# EAGLE schematic Alimentacion_doble (EAGLE 7.7.0)
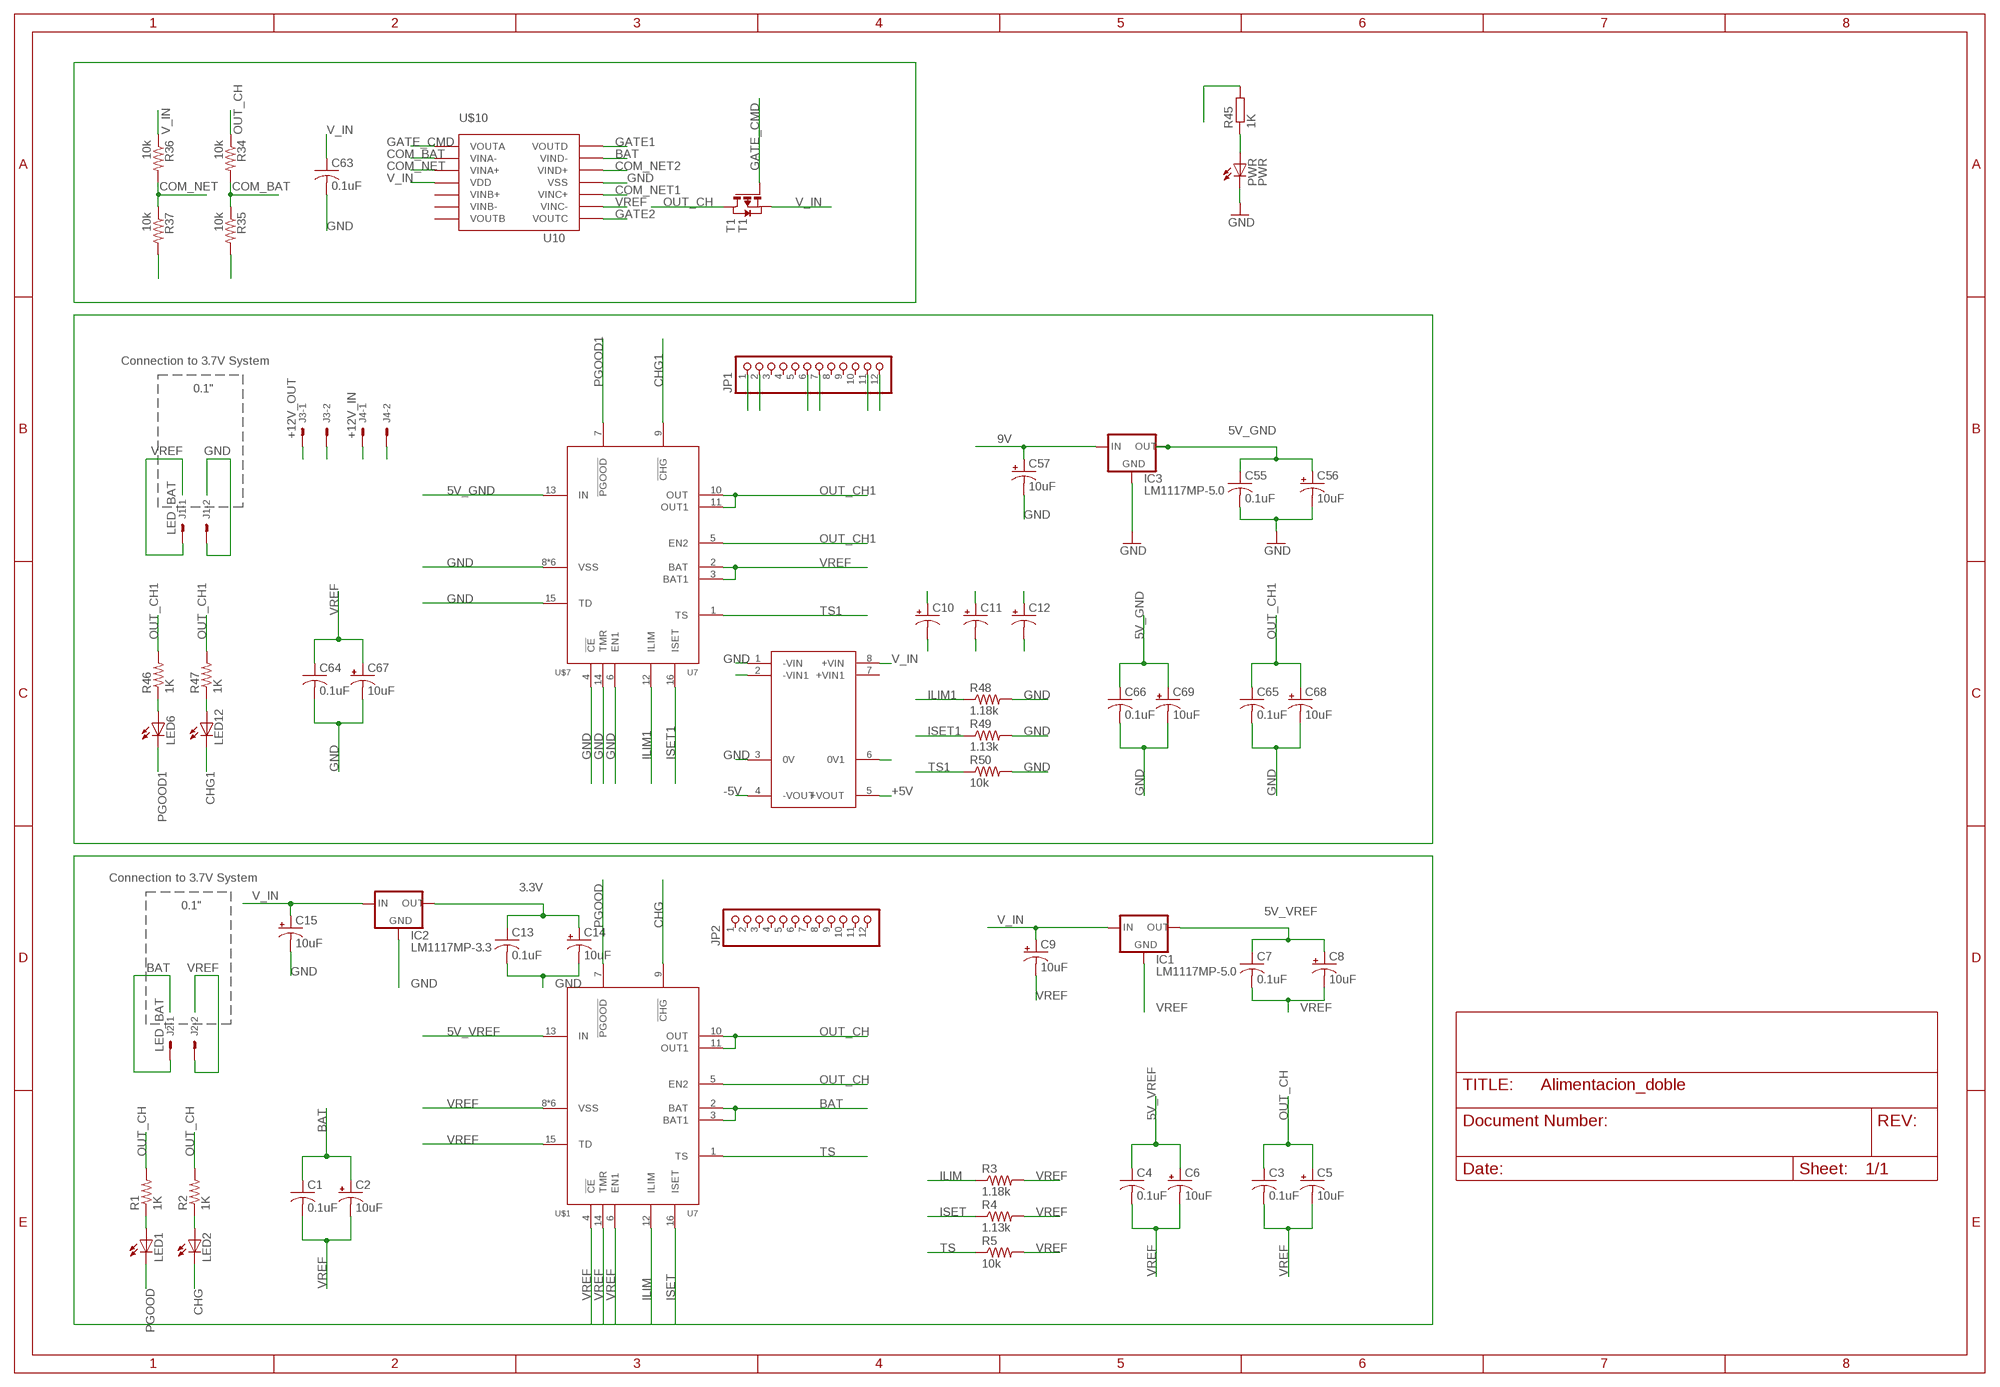
[diagram p0: schematic, sheet 1]

## Parts
C1  0.1uF  C-USC0805K  [C0805K]
C2  10uF  CPOL-USB/3528-21W  [B/3528-21W]
C3  0.1uF  C-USC0805K  [C0805K]
C4  0.1uF  C-USC0805K  [C0805K]
C5  10uF  CPOL-USB/3528-21W  [B/3528-21W]
C6  10uF  CPOL-USB/3528-21W  [B/3528-21W]
C7  0.1uF  C-USC0805K  [C0805K]
C8  10uF  CPOL-USB/3528-21W  [B/3528-21W]
C9  10uF  CPOL-USB/3528-21W  [B/3528-21W]
C10  CPOL-USB/3528-21W  [B/3528-21W]
C11  CPOL-USB/3528-21W  [B/3528-21W]
C12  CPOL-USB/3528-21W  [B/3528-21W]
C13  0.1uF  C-USC0805K  [C0805K]
C14  10uF  CPOL-USB/3528-21W  [B/3528-21W]
C15  10uF  CPOL-USB/3528-21W  [B/3528-21W]
C55  0.1uF  C-USC0805K  [C0805K]
C56  10uF  CPOL-USB/3528-21W  [B/3528-21W]
C57  10uF  CPOL-USB/3528-21W  [B/3528-21W]
C63  0.1uF  C-USC0805K  [C0805K]
C64  0.1uF  C-USC0805K  [C0805K]
C65  0.1uF  C-USC0805K  [C0805K]
C66  0.1uF  C-USC0805K  [C0805K]
C67  10uF  CPOL-USB/3528-21W  [B/3528-21W]
C68  10uF  CPOL-USB/3528-21W  [B/3528-21W]
C69  10uF  CPOL-USB/3528-21W  [B/3528-21W]
IC1  LM1117MP-5.0  [SOT223]
IC2  LM1117MP-3.3  LM1117MP-5.0  [SOT223]
IC3  LM1117MP-5.0  [SOT223]
J1  LED_BAT  22-27-2021-02  [6410-02]
J2  LED_BAT  22-27-2021-02  [6410-02]
J3  +12V_OUT  22-27-2021-02  [6410-02]
J4  +12V_IN  22-27-2021-02  [6410-02]
JP1  PINHD-1X12  [1X12]
JP2  PINHD-1X12  [1X12]
LED1  LED3MM  [LED3MM]
LED2  LED3MM  [LED3MM]
LED6  LED3MM  [LED3MM]
LED12  LED3MM  [LED3MM]
PWR  PWR  LED3MM  [LED3MM]
R1  1K  R-US_M0805  [M0805]
R2  1K  R-US_M0805  [M0805]
R3  1.18k  R-US_M0805  [M0805]
R4  1.13k  R-US_M0805  [M0805]
R5  10k  R-US_M0805  [M0805]
R34  10k  R-US_M0805  [M0805]
R35  10k  R-US_M0805  [M0805]
R36  10k  R-US_M0805  [M0805]
R37  10k  R-US_M0805  [M0805]
R45  1K  R-EU_R0805  [R0805]
R46  1K  R-US_M0805  [M0805]
R47  1K  R-US_M0805  [M0805]
R48  1.18k  R-US_M0805  [M0805]
R49  1.13k  R-US_M0805  [M0805]
R50  10k  R-US_M0805  [M0805]
T1  T1  PMOSSOT23  [SOT-23]
U$1  U7  BQ24072VQFN-16  [BQ24232]
U$2  NDTD_CONVERTER  [NDTD_CONVERTER]
U$7  U7  BQ24072VQFN-16  [BQ24232]
U$10  U10  MCP6294TSSOP-14  [MCP6294]

## Nets
3.3V: C13.1 C14.+ IC2.2(OUT) IC2.4(OUT) JP1.6
5V_GND: C55.1 C56.+ C66.1 C69.+ IC3.2(OUT) IC3.4(OUT) U$7.13(IN)
5V_VREF: C4.1 C6.+ C7.1 C8.+ IC1.2(OUT) IC1.4(OUT) U$1.13(IN)
9V: C57.+ IC3.3(IN)
+5V: C12.+ JP1.1 U$2.5(+VOUT)
-5V: C11.+ JP1.12 U$2.4(-VOUT)
BAT: C1.1 C2.+ J2.1 U$1.2(BAT) U$1.3(BAT1) U$10.VIND-
CHG: LED2.K(C) U$1.9(!CHG!)
CHG1: LED12.K(C) U$7.9(!CHG!)
COM_BAT: R34.2 R35.1 U$10.VINA-
COM_NET: R36.2 R37.1 U$10.VINA+
COM_NET1: U$10.VINC+
COM_NET2: U$10.VIND+
GATE1: U$10.VOUTD
GATE2: U$10.VOUTC
GATE_CMD: T1.3(G) U$10.VOUTA
GND: C10.- C11.- C12.- C13.2 C14.- C15.- C55.2 C56.- C57.- C63.2 C64.2 C65.2 C66.2 C67.- C68.- C69.- IC2.1(GND) IC3.1(GND) J1.2 J3.2 J4.2 JP1.2 JP1.7 JP1.11 PWR.K(C) R35.2 R37.2 R48.2 R49.2 R50.2 U$2.1(-VIN) U$2.3(0V) U$2.6(0V1) U$7.4(!CE!) U$7.6(EN1) U$7.8(VSS) U$7.14(TMR) U$7.15(TD) U$7.NA0(VSS) U$7.NA1(VSS) U$7.NA2(VSS) U$7.NA3(VSS) U$7.NA4(VSS) U$10.VSS
ILIM: R3.1 U$1.12(ILIM)
ILIM1: R48.1 U$7.12(ILIM)
ISET: R4.1 U$1.16(ISET)
ISET1: R49.1 U$7.16(ISET)
N$1: LED1.A R1.1
N$2: LED2.A R2.1
N$7: U$2.2(-VIN1)
N$27: PWR.A R45.1
N$28: LED6.A R46.1
N$29: LED12.A R47.1
OUT_CH: C3.1 C5.+ R1.2 R2.2 R34.1 T1.1(D) U$1.5(EN2) U$1.10(OUT) U$1.11(OUT1)
OUT_CH1: C65.1 C68.+ R46.2 R47.2 U$7.5(EN2) U$7.10(OUT) U$7.11(OUT1)
PGOOD: LED1.K(C) U$1.7(!PGOOD!)
PGOOD1: LED6.K(C) U$7.7(!PGOOD!)
TS: R5.1 U$1.1(TS)
TS1: R50.1 U$7.1(TS)
V_IN: C9.+ C10.+ C15.+ C63.1 IC1.3(IN) IC2.3(IN) J3.1 J4.1 R36.1 R45.2 T1.2(S) U$2.8(+VIN) U$10.VDD
VREF: C1.2 C2.- C3.2 C4.2 C5.- C6.- C7.2 C8.- C9.- C64.1 C67.+ IC1.1(GND) J1.1 J2.2 R3.2 R4.2 R5.2 U$1.4(!CE!) U$1.6(EN1) U$1.8(VSS) U$1.14(TMR) U$1.15(TD) U$1.NA0(VSS) U$1.NA1(VSS) U$1.NA2(VSS) U$1.NA3(VSS) U$1.NA4(VSS) U$7.2(BAT) U$7.3(BAT1) U$10.VINC-
Unconnected: JP1.3 JP1.4 JP1.5 JP1.8 JP1.9 JP1.10 JP2.1 JP2.2 JP2.3 JP2.4 JP2.5 JP2.6 JP2.7 JP2.8 JP2.9 JP2.10 JP2.11 JP2.12 U$2.7(+VIN1) U$10.VINB+ U$10.VINB- U$10.VOUTB

## Notes on the sheet
- Connection to 3.7V System
- 0.1"
- Connection to 3.7V System
- 0.1"

## Library data of the parts
C1 C3 C4 C7 C13 C55 C63-C66 = rcl:C-US: CAPACITOR, American symbol
C2 C5 C6 C8-C12 C14 C15 C56 C57 C67-C69 = rcl:CPOL-US: POLARIZED CAPACITOR, American symbol
IC1-IC3 = lm1117_10:LM1117?-*: 800mA Low-Dropout Linear Regulator Source: http://www.ti.com/lit/ds/symlink/lm1117-n.pdf; MF: Texas Instruments; MPN: LM1117MP-5.0; OC_FARNELL: 9778209; OC_NEWARK: 28X3417
J1-J4 = con-molex:22-?-02: CONNECTOR wire to board 2.54 mm (.1 inch) pitch header; OC_FARNELL: unknown; OC_NEWARK: unknown
JP1 JP2 = pinhead:PINHD-1X12: PIN HEADER
LED1 LED2 LED6 LED12 PWR = led:LED: LED OSRAM: - CHIPLED LG R971, LG N971, LY N971, LG Q971, LY Q971, LO R971, LY R971 LH N974, LH R974 LS Q976, LO Q976, LY Q976 LO Q996 - Hyper CHIPLED LW Q18S LB Q993, LB Q99A, LB R99A - SideLED LS A670, LO A670, LY A670, LG A670, LP A670 LB A673, LV A673, LT A673, LW A673 LH A674 LY A675 LS A676, LA A676, LO A676, LY A676, LW A676 LS A679, LY A679, LG A679 - Hyper Micro SIDELED® LS Y876, LA Y876, LO Y876, LY Y876 LT Y87S - SmartLED LW L88C, LW L88S LB L89C, LB L89S, LG L890 LS L89K, LO L89K, LY L89K LS L896, LA L896, LO L896, LY L896 - TOPLED LS T670, LO T670, LY T670, LG T670, LP T670 LSG T670, LSP T670, LSY T670, LOP T670, LYG T670 LG T671, LOG T671, LSG T671 LB T673, LV T673, LT T673, LW T673 LH T674 LS T676, LA T676, LO T676, LY T676, LB T676, LH T676, LSB T676, LW T676 LB T67C, LV T67C, LT T67C, LS T67K, LO T67K, LY T67K, LW E67C LS E67B, LA E67B, LO E67B, LY E67B, LB E67C, LV E67C, LT E67C LW T67C LS T679, LY T679, LG T679 LS T770, LO T770, LY T770, LG T770, LP T770 LB T773, LV T773, LT T773, LW T773 LH T774 LS E675, LA E675, LY E675, LS T675 LS T776, LA T776, LO T776, LY T776, LB T776 LHGB T686 LT T68C, LB T68C - Hyper Mini TOPLED® LB M676 - Mini TOPLED Santana® LG M470 LS M47K, LO M47K, LY M47K Source: http://www.osram.convergy.de LUXEON: - LUMILED® LXK2-PW12-R00, LXK2-PW12-S00, LXK2-PW14-U00, LXK2-PW14-V00 LXK2-PM12-R00, LXK2-PM12-S00, LXK2-PM14-U00 LXK2-PE12-Q00, LXK2-PE12-R00, LXK2-PE12-S00, LXK2-PE14-T00, LXK2-PE14-U00 LXK2-PB12-K00, LXK2-PB12-L00, LXK2-PB12-M00, LXK2-PB14-N00, LXK2-PB14-P00, LXK2-PB14-Q00 LXK2-PR12-L00, LXK2-PR12-M00, LXK2-PR14-Q00, LXK2-PR14-R00 LXK2-PD12-Q00, LXK2-PD12-R00, LXK2-PD12-S00 LXK2-PH12-R00, LXK2-PH12-S00 LXK2-PL12-P00, LXK2-PL12-Q00, LXK2-PL12-R00 Source: www.luxeon.com KINGBRIGHT: KA-3528ASYC Source: www.kingbright.com
R1-R5 R34-R37 R46-R50 = rcl:R-US_: RESISTOR, American symbol
R45 = rcl:R-EU_: RESISTOR, European symbol
T1 = zetex:PMOSSOT23: MOS FET; OC_FARNELL: unknown; OC_NEWARK: unknown
U$1 U$7 = Texas_IC_BAT:BQ24072: 1.5A USB Friendly Lithium-Ion Battery Charger and Power-Path Management IC bq24072 Mfn: Texas Instruments
U$2 = NDTD_CONVERTER:NDTD_CONVERTER
U$10 = mcp6294:MCP6294: 1.0mA, 10MHz Rail-to-Rail Op Amp MCP6294